# Altium schematic sheet Ammeter.SchDoc
size A; SheetNumber: 7; SheetTotal: 8; SPICEModelCacheFFTHAXDY: <root> / <DocumentId>FFTHAXDY</DocumentId> / </root>
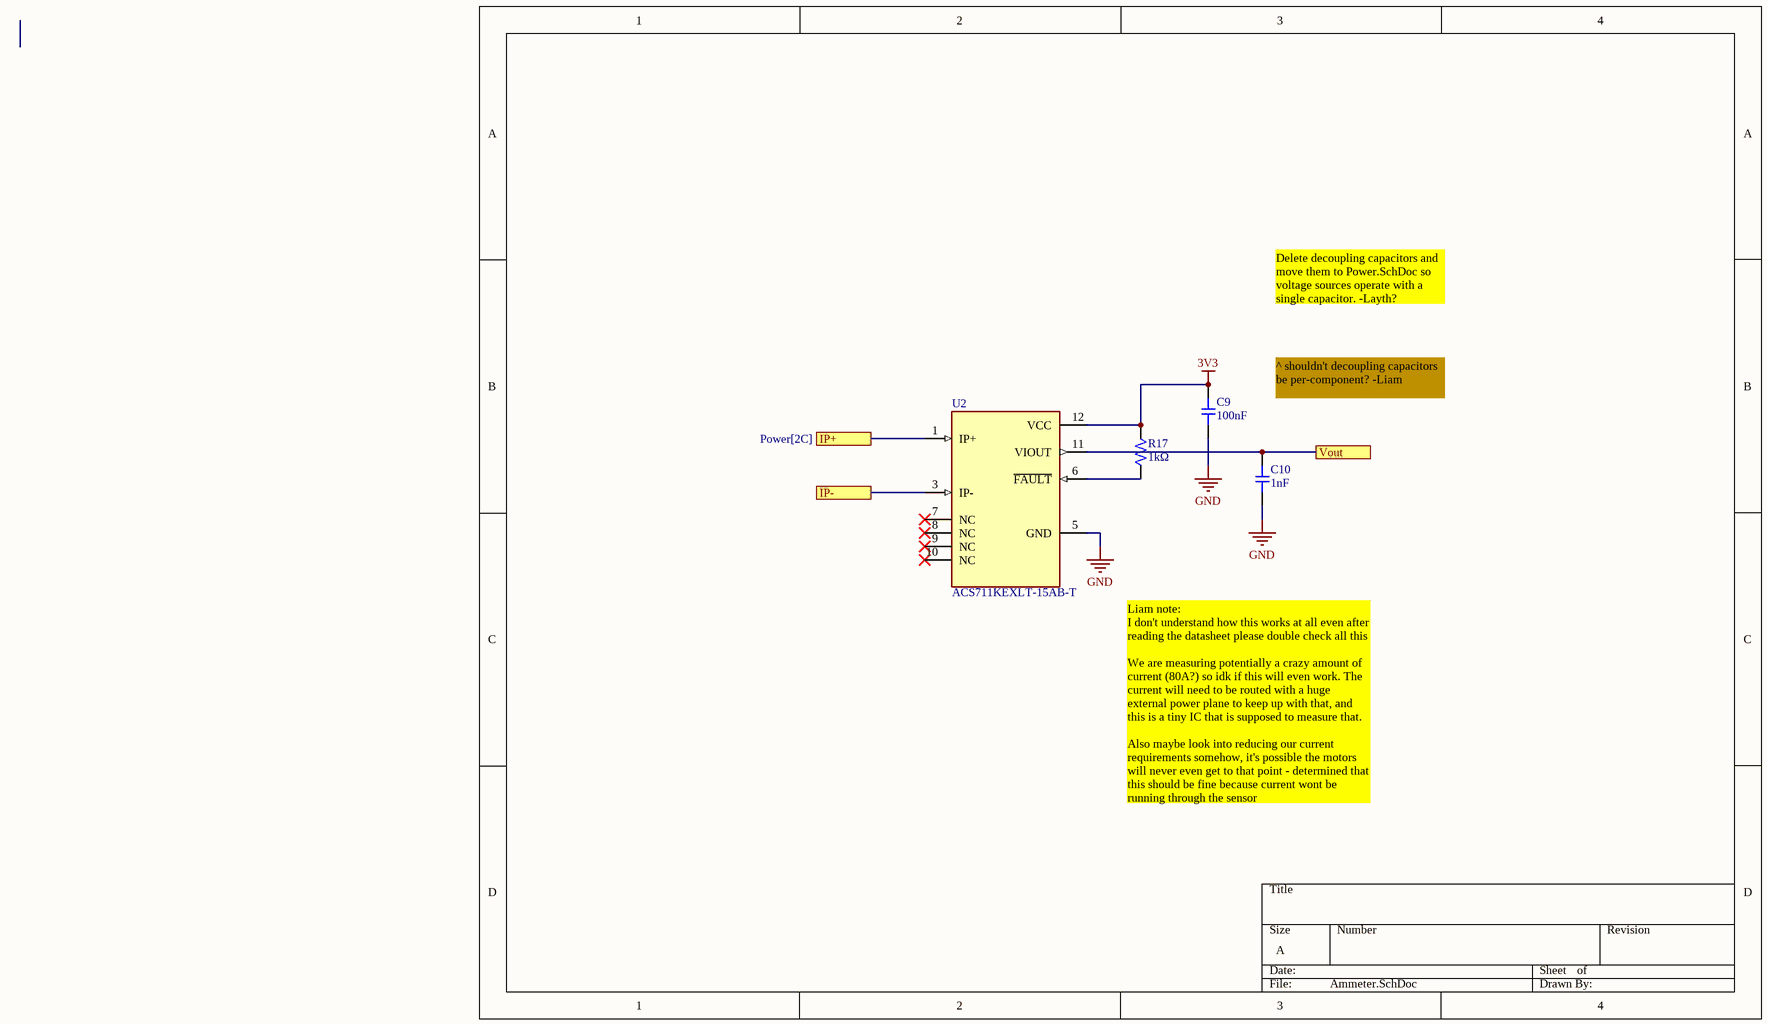
[diagram p0: Ammeter.SchDoc]

## Parts
C9  Capacitance: 100nF  [CAP-0805]  (hidden comment: CC0805KRX7R9BB104)
C10  Capacitance: 1nF  [CAP-0805]  (hidden comment: CL21B102KBCNNNC)
R17  Resistance: 1kΩ  [RES-0603]
U2  ACS711KEXLT-15AB-T  [XDCR_ACS711KEXLT-15AB-T]

## Ports
IP+ (see Power[2C]), IP- (see Power[2C]), Vout (see Power[2C])

## Nets
3V3: C9.2 R17.2 U2.12(VCC)
GND: C9.1 C10.1 U2.5(GND)
IP+: U2.1(IP+) ; port IP+
IP-: U2.3(IP-) ; port IP-
Vout: C10.2 U2.11(VIOUT) ; port Vout
NetR17_1: R17.1 U2.6(~{FAULT})

Not connected (* = marked no-connect by the designer): U2 7(NC)* 8(NC)* 9(NC)* 10(NC)*

## Notes on the sheet
- Delete decoupling capacitors and move them to Power.SchDoc so voltage sources operate with a single capacitor. -Layth?
- ^ shouldn't decoupling capacitors be per-component? -Liam
- Liam note:
  I don't understand how this works at all even after reading the datasheet please double check all this
  We are measuring potentially a crazy amount of current (80A?) so idk if this will even work. The current will need to be routed with a huge external power plane to keep up with that, and this is a tiny IC that is supposed to measure that.
  Also maybe look into reducing our current requirements somehow, it's possible the motors will never even get to that point - determined that this should be fine because current wont be running through the sensor

## Library data of the parts
C9 = CC0805KRX7R9BB104: Capacitor, Ceramic (MLCC), 100nF, ±10%, 50V, X7R, ±10%, SMD 0805; Manufacturer: YAGEO; Package Size: 0805; JLCPCB Basic Part: Yes; JLCPCB Part Number: C49678; Supplier 1: LCSC; Category: Capacitors - MLCC; Supplier Part Number 1: C49678; Manufacturer Part Number: CC0805KRX7R9BB104; Tolerance: ±10%; Voltage Rating: 50V; Temperature Coefficient: X7R; RoHS: Yes; ComponentLink1Description: Datasheet; ComponentLink1URL: https://wmsc.lcsc.com/wmsc/upload/file/pdf/v2/lcsc/2304140030_YAGEO-CC0805KRX7R9BB104_C49678.pdf; ComponentLink2Description: JLCPCB Part URL; ComponentLink2URL: https://jlcpcb.com/partdetail/C49678; ComponentLink3Description: LCSC Part URL; ComponentLink3URL: https://lcsc.com/product-detail/Multilayer-Ceramic-Capacitors-MLCC---SMD-SMT_YAGEO-YAGEO-CC0805KRX7R9BB104_C49678.html
C10 = CL21B102KBCNNNC: Capacitor, Ceramic (MLCC), 1nF, ±10%, 50V, X7R, ±10%, SMD 0805; Manufacturer: Samsung Electro-Mechanics; Temperature Rating: -55°C ~ 125°C; Capacitance @ 1V DC Bias: 1.006nF; Capacitance @ 1.2V DC Bias: 1.008nF; Capacitance @ 1.35V DC Bias: 1.009nF; Capacitance @ 1.8V DC Bias: 1.011nF; Capacitance @ 2.5V DC Bias: 1.013nF; Capacitance @ 3.3V DC Bias: 1.014nF; Capacitance @ 3.7V DC Bias: 1.015nF; Capacitance @ 4.2V DC Bias: 1.017nF; Capacitance @ 5V DC Bias: 1.018nF; Capacitance @ 9V DC Bias: 1.022nF; Capacitance @ 12V DC Bias: 1.021nF; Capacitance @ 15V DC Bias: 1.020nF; Capacitance @ 24V DC Bias: 1.012nF; Capacitance @ 36V DC Bias: 0.995nF; Capacitance @ 48V DC Bias: 0.975nF; Impedance (0V Bias) @ 100Hz: 1.39E+06Ω; Impedance (0V Bias) @ 500Hz: 2.85E+05Ω; Impedance (0V Bias) @ 1kHz: 1.43E+05Ω; Impedance (0V Bias) @ 5kHz: 2.92E+04Ω; Impedance (0V Bias) @ 10kHz: 1.47E+04Ω; Impedance (0V Bias) @ 50kHz: 3E+03Ω; Impedance (0V Bias) @ 100kHz: 1.51E+03Ω; Impedance (0V Bias) @ 500kHz: 307Ω; Impedance (0V Bias) @ 1MHz: 155Ω; Impedance (0V Bias) @ 5MHz: 31.6Ω; Impedance (0V Bias) @ 10MHz: 15.9Ω; Impedance (0V Bias) @ 50MHz: 3.25Ω; Impedance (0V Bias) @ 100MHz: 1.41Ω; Impedance (0V Bias) @ 500MHz: 1.58Ω; Impedance (0V Bias) @ 1GHz: 3.83Ω; Impedance (0V Bias) @ 2GHz: 12.4Ω; Impedance (0V Bias) @ 5GHz: 7.64Ω; Package Size: 0805; JLCPCB Basic Part: Yes; JLCPCB Part Number: C46653; Supplier 1: LCSC; Category: Capacitors - MLCC; Supplier Part Number 1: C46653; Manufacturer Part Number: CL21B102KBCNNNC; Tolerance: ±10%; Voltage Rating: 50V; Temperature Coefficient: X7R; RoHS: Yes; ComponentLink1Description: Datasheet; ComponentLink1URL: https://wmsc.lcsc.com/wmsc/upload/file/pdf/v2/lcsc/2304140030_Samsung-Electro-Mechanics-CL21B102KBCNNNC_C46653.pdf; ComponentLink2Description: JLCPCB Part URL; ComponentLink2URL: https://jlcpcb.com/partdetail/C46653; ComponentLink3Description: LCSC Part URL; ComponentLink3URL: https://lcsc.com/product-detail/Multilayer-Ceramic-Capacitors-MLCC---SMD-SMT_Samsung-Electro-Mechanics-Samsung-Electro-Mechanics-CL21B102KBCNNNC_C46653.html; ComponentLink4Description: Samsung Component Library; ComponentLink4URL: https://weblib.samsungsem.com/mlcc/mlcc-ec.do?partNumber=CL21B102KBCNNN; Capacitance @ 1.5V DC Bias: 1.009nF
R17 = 0603WAF1001T5E: Resistor, 1kΩ, ±1%, 100mW, 75V, ±100ppm/℃, -55℃~+155℃, SMD 0603; Manufacturer: Uniroyal; Supplier 1: LCSC; Manufacturer Part Number: 0603WAF1001T5E; Supplier Part Number 1: C21190; JLCPCB Part Number: C21190; Power Rating: 100mW; Category: Resistors; Package Size: 0603; JLCPCB Basic Part: Yes; Tolerance: ±1%; Voltage Rating: 75V; Temperature Coefficient: ±100ppm/℃; Temperature Rating: -55℃~+155℃; ComponentLink1Description: Datasheet; ComponentLink1URL: https://wmsc.lcsc.com/wmsc/upload/file/pdf/v2/lcsc/2206010130_UNI-ROYAL-Uniroyal-Elec-0603WAF1001T5E_C21190.pdf; ComponentLink2Description: JLCPCB Part URL; ComponentLink2URL: https://jlcpcb.com/partdetail/C21190
U2 = ACS711KEXLT-15AB-T: Current Sensor 15.5A 1 Channel Hall Effect, Open Loop Bidirectional 12-PowerWFQFN; MF: Allegro MicroSystems LLC; Package: PowerWFQFN-12 Allegro MicroSystems LLC; Value: *; MP: ACS711KEXLT-15AB-T; SnapEDA_Link: https://www.snapeda.com/parts/ACS711KEXLT-15AB-T/Allegro/view-part/?ref=snap; Check_prices: https://www.snapeda.com/parts/ACS711KEXLT-15AB-T/Allegro/view-part/?ref=eda